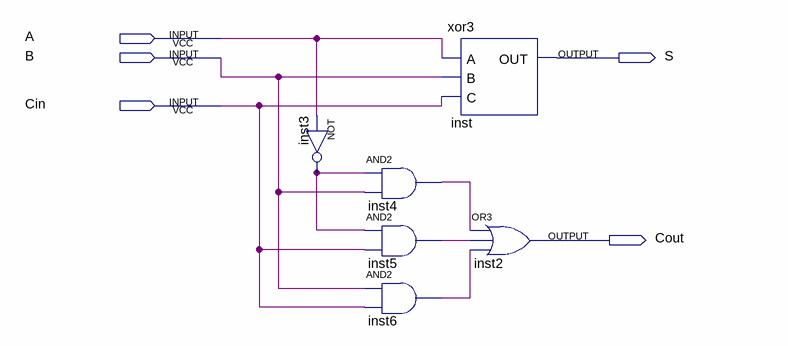
[diagram p0: schematic sheet]
// Quartus schematic full_subtractor.bdf as structural Verilog: 6 symbols, 5 pins
module full_subtractor (
  input  A,
  input  B,
  input  Cin,
  output S,
  output Cout
);

  wire inst3_out, inst4_out, inst5_out, inst6_out;

  not inst3 (inst3_out, A);
  and inst4 (inst4_out, inst3_out, B);
  and inst5 (inst5_out, inst3_out, Cin);
  and inst6 (inst6_out, B, Cin);
  xor3 inst (.A(A), .B(B), .C(Cin), .OUT(S));
  or inst2 (Cout, inst4_out, inst5_out, inst6_out);
endmodule
